# EAGLE design controller_mini (EAGLE 6.1)
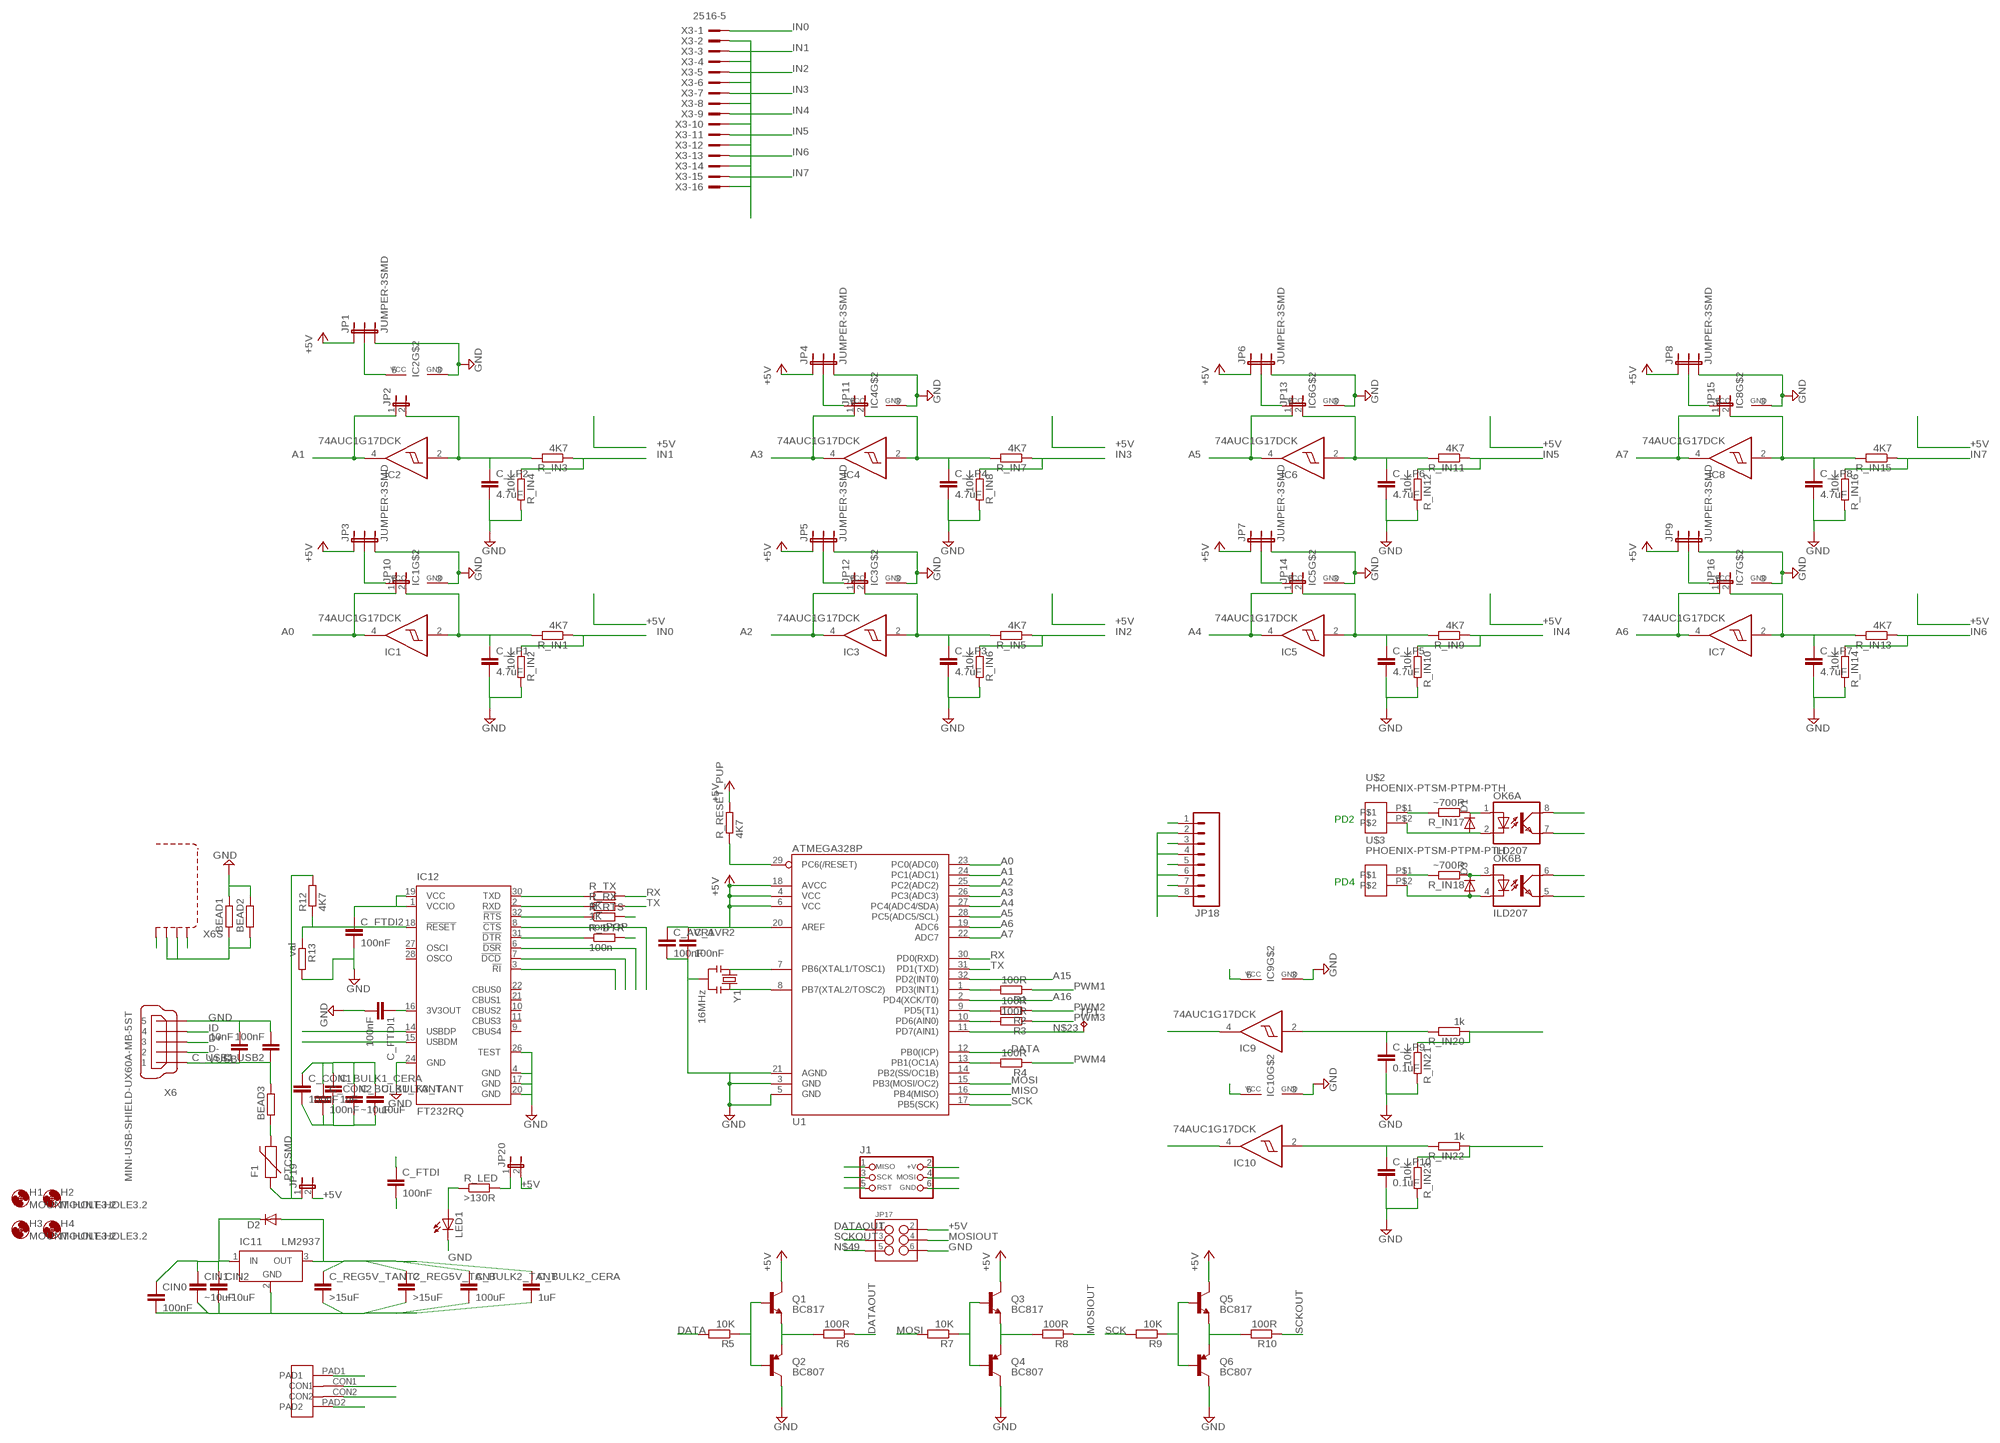
[diagram p0: schematic, sheet 1]

## Parts
BEAD1  R-EU_R0805  [R0805]
BEAD2  R-EU_R0805  [R0805]
BEAD3  R-EU_R0805  [R0805]
C_AVR1  100nF  C-EUC0805  [C0805]
C_AVR2  100nF  C-EUC0805  [C0805]
C_BULK1_CERA  1uF  C-EUC0805K  [C0805K]
C_BULK1_TANT  ~10uF  C-EUC1210  [C1210]
C_BULK2_CERA  1uF  C-EUC0805K  [C0805K]
C_BULK2_TANT  100uF  C-EUC1210  [C1210]
C_BULK3_TANT  10uF  C-EUC1210  [C1210]
C_CON1  100nF  C-EUC0805  [C0805]
C_CON2  100nF  C-EUC0805  [C0805]
C_FTDI  100nF  C-EUC0805  [C0805]
C_FTDI1  100nF  C-EUC0805  [C0805]
C_FTDI2  100nF  C-EUC0805  [C0805]
C_LP1  4.7uF  C-EUC0805  [C0805]
C_LP2  4.7uF  C-EUC0805  [C0805]
C_LP3  4.7uF  C-EUC0805  [C0805]
C_LP4  4.7uF  C-EUC0805  [C0805]
C_LP5  4.7uF  C-EUC0805  [C0805]
C_LP6  4.7uF  C-EUC0805  [C0805]
C_LP7  4.7uF  C-EUC0805  [C0805]
C_LP8  4.7uF  C-EUC0805  [C0805]
C_LP9  0.1uF  C-EUC0805  [C0805]
C_LP10  0.1uF  C-EUC0805  [C0805]
C_REG5V_TANT  >15uF  C-EUC1210  [C1210]
C_REG5V_TANT2  >15uF  C-EUC1210  [C1210]
C_USB1  10nF  C-EUC0805  [C0805]
C_USB2  100nF  C-EUC0805  [C0805]
CIN0  100nF  C-EUC0805  [C0805]
CIN1  ~10uF  C-EUC1210  [C1210]
CIN2  ~10uF  C-EUC1210  [C1210]
D1  DIODE-MICROMELF-W  [MICROMELF-W]
D2  DIODESMA  [SMA-DIODE]
D3  DIODE-MICROMELF-W  [MICROMELF-W]
F1  PTCSMD  [PTC-1206]
H1  MOUNT-HOLE3.2  [3,2]
H2  MOUNT-HOLE3.2  [3,2]
H3  MOUNT-HOLE3.2  [3,2]
H4  MOUNT-HOLE3.2  [3,2]
IC1  74AUC1G17DCK  [SC70-5]
IC2  74AUC1G17DCK  [SC70-5]
IC3  74AUC1G17DCK  [SC70-5]
IC4  74AUC1G17DCK  [SC70-5]
IC5  74AUC1G17DCK  [SC70-5]
IC6  74AUC1G17DCK  [SC70-5]
IC7  74AUC1G17DCK  [SC70-5]
IC8  74AUC1G17DCK  [SC70-5]
IC9  74AUC1G17DCK  [SC70-5]
IC10  74AUC1G17DCK  [SC70-5]
IC11  LM2937  LT1963EST-3.3  [SOT223]
IC12  FT232RQ  [QFN32]
J1  CON_HEADER_PRG_AVR_ICSP  [HEADER_PRG_2X03]
JP1  JUMPER-3SMD  [SJ_3]
JP2  JUMPER-2SMD-NO  [SJ_2S-NO]
JP3  JUMPER-3SMD  [SJ_3]
JP4  JUMPER-3SMD  [SJ_3]
JP5  JUMPER-3SMD  [SJ_3]
JP6  JUMPER-3SMD  [SJ_3]
JP7  JUMPER-3SMD  [SJ_3]
JP8  JUMPER-3SMD  [SJ_3]
JP9  JUMPER-3SMD  [SJ_3]
JP10  JUMPER-2SMD-NO  [SJ_2S-NO]
JP11  JUMPER-2SMD-NO  [SJ_2S-NO]
JP12  JUMPER-2SMD-NO  [SJ_2S-NO]
JP13  JUMPER-2SMD-NO  [SJ_2S-NO]
JP14  JUMPER-2SMD-NO  [SJ_2S-NO]
JP15  JUMPER-2SMD-NO  [SJ_2S-NO]
JP16  JUMPER-2SMD-NO  [SJ_2S-NO]
JP17  M03X2NO_SILK  [2X3-NS]
JP18  M08LOCK  [1X08_LOCK]
JP19  JUMPER-2SMD-NC  [SJ_2S]
JP20  JUMPER-2SMD-NC  [SJ_2S]
LED1  LEDCHIP-LED0805  [CHIP-LED0805]
OK6  ILD207  [SOIC08]
Q1  BC817  TRANSISTOR_NPNSOT23-3  [SOT23-3]
Q2  BC807  TRANSISTOR_PNPSMD  [SOT23-3]
Q3  BC817  TRANSISTOR_NPNSOT23-3  [SOT23-3]
Q4  BC807  TRANSISTOR_PNPSMD  [SOT23-3]
Q5  BC817  TRANSISTOR_NPNSOT23-3  [SOT23-3]
Q6  BC807  TRANSISTOR_PNPSMD  [SOT23-3]
R1  100R  R-EU_M0805  [M0805]
R2  100R  R-EU_M0805  [M0805]
R3  100R  R-EU_M0805  [M0805]
R4  100R  R-EU_R0805W  [R0805W]
R5  10K  R-EU_M0805  [M0805]
R6  100R  R-EU_M0805  [M0805]
R7  10K  R-EU_M0805  [M0805]
R8  100R  R-EU_M0805  [M0805]
R9  10K  R-EU_M0805  [M0805]
R10  100R  R-EU_M0805  [M0805]
R12  4K7  R-EU_R0805  [R0805]
R13  val  R-EU_R0805  [R0805]
R_DTR  100n  R-EU_M0805  [M0805]
R_IN1  4K7  R-EU_M0805  [M0805]
R_IN2  10K  R-EU_M0805  [M0805]
R_IN3  4K7  R-EU_M0805  [M0805]
R_IN4  10K  R-EU_M0805  [M0805]
R_IN5  4K7  R-EU_M0805  [M0805]
R_IN6  10K  R-EU_M0805  [M0805]
R_IN7  4K7  R-EU_M0805  [M0805]
R_IN8  10K  R-EU_M0805  [M0805]
R_IN9  4K7  R-EU_M0805  [M0805]
R_IN10  10K  R-EU_M0805  [M0805]
R_IN11  4K7  R-EU_M0805  [M0805]
R_IN12  10K  R-EU_M0805  [M0805]
R_IN13  4K7  R-EU_M0805  [M0805]
R_IN14  10K  R-EU_M0805  [M0805]
R_IN15  4K7  R-EU_M0805  [M0805]
R_IN16  10K  R-EU_M0805  [M0805]
R_IN17  ~700R  R-EU_M1206  [M1206]
R_IN18  ~700R  R-EU_M1206  [M1206]
R_IN20  1k  R-EU_M0805  [M0805]
R_IN21  10K  R-EU_M0805  [M0805]
R_IN22  1k  R-EU_M0805  [M0805]
R_IN23  10K  R-EU_M0805  [M0805]
R_LED  >130R  R-EU_M0805  [M0805]
R_RESET_PUP  4K7  R-EU_M0805  [M0805]
R_RTS  nonPOP  R-EU_M0805  [M0805]
R_RX  1K  R-EU_M0805  [M0805]
R_TX  1K  R-EU_M0805  [M0805]
TP1  TPTP10R  [TP10R]
U1  ATMEGA328P  ATMEGA328_SMT  [TQFP32-08]
U$1  PHOENIX-PTSM-PTPM  [PTSM-SMD-2.5MM-2]
U$2  PHOENIX-PTSM-PTPM-PTH  [PTSM-PTH-2.5MM-2]
U$3  PHOENIX-PTSM-PTPM-PTH  [PTSM-PTH-2.5MM-2]
X3  2516-5  [PAK100/2500-5-16]
X6  MINI-USB-SHIELD-UX60A-MB-5ST  [UX60A-MB-5ST]
Y1  16MHz  RESONATOR16MHZ  [RESONATOR-SMD]

## Nets
+5V: C_AVR1.1 C_AVR2.1 C_BULK1_CERA.1 C_BULK1_TANT.1 C_BULK2_CERA.1 C_BULK2_TANT.1 C_BULK3_TANT.1 C_CON1.1 C_CON2.1 C_FTDI2.1 C_FTDI.1 C_REG5V_TANT2.1 C_REG5V_TANT.1 D2.A IC9.5(VCC) IC10.5(VCC) IC11.3(OUT) IC12.1(VCCIO) IC12.19(VCC) J1.2(+V) JP1.1 JP3.1 JP4.1 JP5.1 JP6.1 JP7.1 JP8.1 JP9.1 JP17.2 JP19.2 JP20.2 OK6.6(B:COL) OK6.8(A:COL) Q1.3(C) Q3.3(C) Q5.3(C) R_RESET_PUP.2 U1.4(VCC) U1.6(VCC) U1.18(AVCC) U1.20(AREF) X3.2 X3.4 X3.6 X3.8 X3.10 X3.12 X3.14 X3.16
A0: IC1.4(O) JP10.1 U1.23(PC0(ADC0))
A1: IC2.4(O) JP2.1 U1.24(PC1(ADC1))
A2: IC3.4(O) JP12.1 U1.25(PC2(ADC2))
A3: IC4.4(O) JP11.1 U1.26(PC3(ADC3))
A4: IC5.4(O) JP14.1 U1.27(PC4(ADC4/SDA))
A5: IC6.4(O) JP13.1 U1.28(PC5(ADC5/SCL))
A6: IC7.4(O) JP16.1 U1.19(ADC6)
A7: IC8.4(O) JP15.1 U1.22(ADC7)
A15: IC9.4(O) U1.32(PD2(INT0))
A16: IC10.4(O) U1.2(PD4(XCK/T0))
D+: IC12.14(USBDP) X6.3
D-: IC12.15(USBDM) X6.2
DATA: R5.2 U1.12(PB0(ICP))
DATAOUT: JP17.1 R6.1
EROUTE: C_LP8.1 IC8.2(I) JP15.2 R_IN15.2
GND: BEAD1.2 BEAD2.2 C_AVR1.2 C_AVR2.2 C_BULK1_CERA.2 C_BULK1_TANT.2 C_BULK2_CERA.2 C_BULK2_TANT.2 C_BULK3_TANT.2 C_CON1.2 C_CON2.2 C_FTDI1.2 C_FTDI2.2 C_FTDI.2 C_LP1.2 C_LP2.2 C_LP3.2 C_LP4.2 C_LP5.2 C_LP6.2 C_LP7.2 C_LP8.2 C_LP9.2 C_LP10.2 C_REG5V_TANT2.2 C_REG5V_TANT.2 C_USB1.2 C_USB2.2 CIN0.2 CIN1.2 CIN2.2 IC1.3(GND) IC2.3(GND) IC3.3(GND) IC4.3(GND) IC5.3(GND) IC6.3(GND) IC7.3(GND) IC8.3(GND) IC9.3(GND) IC10.3(GND) IC11.2(GND) IC12.4(GND) IC12.17(GND) IC12.20(GND) IC12.24(GND) IC12.26(TEST) J1.6(GND) JP1.3 JP3.3 JP4.3 JP5.3 JP6.3 JP7.3 JP8.3 JP9.3 JP17.6 JP18.2 JP18.4 JP18.6 JP18.8 LED1.C Q2.3(C) Q4.3(C) Q6.3(C) R13.2 R_IN2.2 R_IN4.2 R_IN6.2 R_IN8.2 R_IN10.2 R_IN12.2 R_IN14.2 R_IN16.2 R_IN21.2 R_IN23.2 U1.3(GND) U1.5(GND) U1.21(AGND) U$1.CON2 U$1.PAD1 U$1.PAD2 X6.5 Y1.2
ID: X6.4
IN0: R_IN1.1 R_IN2.1 X3.1
IN1: R_IN3.1 R_IN4.1 X3.3
IN2: R_IN5.1 R_IN6.1 X3.5
IN3: R_IN7.1 R_IN8.1 X3.7
IN4: R_IN9.1 R_IN10.1 X3.9
IN5: R_IN11.1 R_IN12.1 X3.11
IN6: R_IN13.1 R_IN14.1 X3.13
IN7: R_IN15.1 R_IN16.1 X3.15
INFOMOVE: D3.A OK6.4(B:C) U$3.P$2
MISO: J1.1(MISO) U1.16(PB4(MISO))
MOSI: J1.4(MOSI) R7.2 U1.15(PB3(MOSI/OC2))
MOSIOUT: JP17.4 R8.1
N$1: C_LP9.1 IC9.2(I) R_IN20.2
N$2: C_LP2.1 IC2.2(I) JP2.2 R_IN3.2
N$3: D3.C OK6.3(B:A) R_IN18.1
N$4: C_LP3.1 IC3.2(I) JP12.2 R_IN5.2
N$5: U1.7(PB6(XTAL1/TOSC1)) Y1.1
N$6: C_LP4.1 IC4.2(I) JP11.2 R_IN7.2
N$7: D1.C OK6.1(A:A) R_IN17.1
N$8: C_LP5.1 IC5.2(I) JP14.2 R_IN9.2
N$9: BEAD3.1 F1.2
N$10: C_LP6.1 IC6.2(I) JP13.2 R_IN11.2
N$11: U1.8(PB7(XTAL2/TOSC2)) Y1.3
N$12: C_LP7.1 IC7.2(I) JP16.2 R_IN13.2
N$13: R_IN17.2 U$2.P$1
N$14: JP20.1 R_LED.2
N$15: C_LP1.1 IC1.2(I) JP10.2 R_IN1.2
N$16: R_IN18.2 U$3.P$1
N$17: Q1.2(E) Q2.2(E) R6.2
N$18: D1.A OK6.2(A:C) U$2.P$2
N$19: C_LP10.1 IC10.2(I) R_IN22.2
N$20: Q1.1(B) Q2.1(B) R5.1
N$21: OK6.7(A:EMIT) R_IN20.1 R_IN21.1
N$22: OK6.5(B:EMIT) R_IN22.1 R_IN23.1
N$23: TP1.TP U1.11(PD7(AIN1))
N$24: IC12.30(TXD) R_TX.1
N$25: IC12.2(RXD) R_RX.1
N$26: IC12.32(!RTS) R_RTS.1
N$27: IC12.31(!DTR) R_DTR.1
N$28: IC12.8(!CTS)
N$29: IC12.6(!DSR)
N$30: IC12.7(!DCD)
N$31: IC12.3(!RI)
N$32: C_FTDI1.1 IC12.16(3V3OUT)
N$33: IC2.5(VCC) JP1.2
N$34: IC1.5(VCC) JP3.2
N$35: IC4.5(VCC) JP4.2
N$36: IC3.5(VCC) JP5.2
N$37: IC6.5(VCC) JP6.2
N$38: IC5.5(VCC) JP7.2
N$39: IC8.5(VCC) JP8.2
N$40: IC7.5(VCC) JP9.2
N$42: IC12.18(!RESET) R12.1 R13.1
N$43: Q3.2(E) Q4.2(E) R8.2
N$44: Q3.1(B) Q4.1(B) R7.1
N$45: R1.2 U1.1(PD3(INT1))
N$46: R2.2 U1.9(PD5(T1))
N$47: R3.2 U1.10(PD6(AIN0))
N$48: R4.2 U1.13(PB1(OC1A))
N$49: JP17.5
N$50: LED1.A R_LED.1
N$51: Q5.2(E) Q6.2(E) R10.2
N$52: Q5.1(B) Q6.1(B) R9.1
N$54: X6.M4(S4)
N$55: X6.M1(S1)
N$58: BEAD1.1 BEAD2.1 X6.M2(S2) X6.M3(S3)
N$61: F1.1 JP19.1 R12.2
PWM1: JP18.1 R1.1
PWM2: JP18.3 R2.1
PWM3: JP18.5 R3.1
PWM4: JP18.7 R4.1
RESET: J1.5(RST) R_DTR.2 R_RESET_PUP.1 R_RTS.2 U1.29(PC6(/RESET))
RX: R_TX.2 U1.30(PD0(RXD))
SCK: J1.3(SCK) R9.2 U1.17(PB5(SCK))
SCKOUT: JP17.3 R10.1
TX: R_RX.2 U1.31(PD1(TXD))
VIN: CIN0.1 CIN1.1 CIN2.1 D2.C IC11.1(IN) U$1.CON1
VUSB: BEAD3.2 C_USB1.1 C_USB2.1 X6.1
Unconnected: IC12.9(CBUS4) IC12.10(CBUS2) IC12.11(CBUS3) IC12.21(CBUS1) IC12.22(CBUS0) IC12.27(OSCI) IC12.28(OSCO) U1.14(PB2(SS/OC1B))

## Notes on the sheet
- PD2
- PD4

## Power pins joined to a net without a drawn wire
GND: IC11.4(GND)

## Library data of the parts
BEAD1-BEAD3 R12 R13 R_IN1-R_IN18 R_IN20-R_IN23 = rcl:R-EU_: RESISTOR, European symbol
C_AVR1 C_AVR2 C_BULK1_CERA C_BULK1_TANT C_BULK2_CERA C_BULK2_TANT C_BULK3_TANT C_CON1 C_CON2 C_FTDI C_FTDI1 C_FTDI2 C_REG5V_TANT C_REG5V_TANT2 C_USB1 C_USB2 CIN0 CIN1 CIN2 = resistor:C-EU: CAPACITOR, European symbol
C_LP1-C_LP10 = rcl:C-EU: CAPACITOR, European symbol
D1 D3 = diode:DIODE-: DIODE
D2 = SparkFun-DiscreteSemi:DIODE: Diode These are standard reverse protection diodes and small signal diodes. SMA package can handle up to about 1A. SOD-323 can handle about 200mA. What the SOD-323 package when ordering, there are some mfgs out there that are 5-pin packages.
F1 = SparkFun-PowerIC:PTC: Resettable Fuse PTC Resettable Fuse. Spark Fun Electronics SKU : COM-08357
H1-H4 = holes:MOUNT-HOLE: MOUNTING HOLE with drill center marker
IC1-IC10 = 74xx-little-us:74*1G17: Single Schmitt-Trigger Buffer
IC11 = linear-technology:LT1963EST: 1.5A, Low Noise, Fast Transient Response LDO Regulator Source: http://www.linear.com/pc/downloadDocument.do?navId=H0,C3,P2222,D3148; MPN: LT1963EST-3.3; OC_FARNELL: 1501032; OC_NEWARK: 57M7546
IC12 = ftdichip:FT232R: Source: http://www.ftdichip.com/Documents/DataSheets/DS_FT232R_v104.pdf; MPN: FT232RQ; OC_FARNELL: 1146033; OC_NEWARK: 91K9919
J1 = nonolith:CON_HEADER_PRG_AVR_ICSP: 2x3 AVR ICSP programming header
JP1 JP3-JP9 = SparkFun-Passives:JUMPER-3
JP2 JP10-JP16 JP19 JP20 = SparkFun-Passives:JUMPER-2: Jumper Basic 0.1" spaced jumper. Use with breakaway headers.
JP17 = SparkFun-Connectors:M03X2: 2x3 .1" header. Shrouded, with keying- CONN-10681 SMT- CONN-11415 Pogo pins- HW-11044
JP18 = SparkFun-Connectors:M08: Header 8 Standard 8-pin 0.1" header. Use with straight break away headers (SKU : PRT-00116), right angle break away headers (PRT-00553), swiss pins (PRT-00743), machine pins (PRT-00117), and female headers (PRT-00115).
LED1 = led:LED: LED OSRAM: - CHIPLED LG R971, LG N971, LY N971, LG Q971, LY Q971, LO R971, LY R971 LH N974, LH R974 LS Q976, LO Q976, LY Q976 LO Q996 - Hyper CHIPLED LW Q18S LB Q993, LB Q99A, LB R99A - SideLED LS A670, LO A670, LY A670, LG A670, LP A670 LB A673, LV A673, LT A673, LW A673 LH A674 LY A675 LS A676, LA A676, LO A676, LY A676, LW A676 LS A679, LY A679, LG A679 - Hyper Micro SIDELED® LS Y876, LA Y876, LO Y876, LY Y876 LT Y87S - SmartLED LW L88C, LW L88S LB L89C, LB L89S, LG L890 LS L89K, LO L89K, LY L89K LS L896, LA L896, LO L896, LY L896 - TOPLED LS T670, LO T670, LY T670, LG T670, LP T670 LSG T670, LSP T670, LSY T670, LOP T670, LYG T670 LG T671, LOG T671, LSG T671 LB T673, LV T673, LT T673, LW T673 LH T674 LS T676, LA T676, LO T676, LY T676, LB T676, LH T676, LSB T676, LW T676 LB T67C, LV T67C, LT T67C, LS T67K, LO T67K, LY T67K, LW E67C LS E67B, LA E67B, LO E67B, LY E67B, LB E67C, LV E67C, LT E67C LW T67C LS T679, LY T679, LG T679 LS T770, LO T770, LY T770, LG T770, LP T770 LB T773, LV T773, LT T773, LW T773 LH T774 LS E675, LA E675, LY E675, LS T675 LS T776, LA T776, LO T776, LY T776, LB T776 LHGB T686 LT T68C, LB T68C - Hyper Mini TOPLED® LB M676 - Mini TOPLED Santana® LG M470 LS M47K, LO M47K, LY M47K Source: http://www.osram.convergy.de LUXEON: - LUMILED® LXK2-PW12-R00, LXK2-PW12-S00, LXK2-PW14-U00, LXK2-PW14-V00 LXK2-PM12-R00, LXK2-PM12-S00, LXK2-PM14-U00 LXK2-PE12-Q00, LXK2-PE12-R00, LXK2-PE12-S00, LXK2-PE14-T00, LXK2-PE14-U00 LXK2-PB12-K00, LXK2-PB12-L00, LXK2-PB12-M00, LXK2-PB14-N00, LXK2-PB14-P00, LXK2-PB14-Q00 LXK2-PR12-L00, LXK2-PR12-M00, LXK2-PR14-Q00, LXK2-PR14-R00 LXK2-PD12-Q00, LXK2-PD12-R00, LXK2-PD12-S00 LXK2-PH12-R00, LXK2-PH12-S00 LXK2-PL12-P00, LXK2-PL12-Q00, LXK2-PL12-R00 Source: www.luxeon.com KINGBRIGHT: KA-3528ASYC Source: www.kingbright.com
OK6 = optocoupler:ILD2*: Siemens ILD205/206/207/211/213/217 DUAL PHOTOTRANSISTOR SMALL OUTLINE SURFACE MOUNT OPTOCOUPLER Source: 153385-da-01-en-Optocoupler_ILD205-T.pdf; MF: VISHAY/TELEFUNKEN; MPN: ILD207T; OC_FARNELL: 1469603; OC_NEWARK: 97C8648
Q1 Q3 Q5 = SparkFun-DiscreteSemi:TRANSISTOR_NPN: Generic NPN BJT MMBT2222A - TRANS-08049 (SOT-23, 1A 40V) MPSA42 - TRANS-09116 (SOT-23, 500mA 300V) MMBT5088LT1G - TRANS-11160 (SOT-23, 50 mA 30V)
Q2 Q4 Q6 = SparkFun-DiscreteSemi:TRANSISTOR_PNP: Generic PNP BJT. Double check pinouts against datasheets- not all devices are the same!
R1-R10 R_DTR R_LED R_RESET_PUP R_RTS R_RX R_TX = resistor:R-EU_: RESISTOR, European symbol
TP1 = testpad:TP: Test pad
U1 = SparkFun-DigitalIC:ATMEGA328_SMT: 32-Pin Atmega328 part Commonly used on Arduino compatible boards Available in QFP and QFN packages TQFP is IC-09069 QFN is non-stock; PROD_ID: IC-09069
U$1 = wes:PHOENIX-PTSM-PTPM
U$2 U$3 = wes:PHOENIX-PTSM-PTPM-PTH
X3 = con-3m:2516-: 3M (TM) Pak 100 4-Wall Header Source: 3M; MPN: D2516-5002-AR; OC_FARNELL: 9838376; OC_NEWARK: 12P7055
X6 = con-hirose:MINI-USB-SHIELD-: MINI USB Connector Source: http://www.hirose.co.jp/cataloge_hp/e24000019.pdf; OC_FARNELL: unknown; OC_NEWARK: unknown
Y1 = SparkFun-FreqCtrl:RESONATOR: Resonator Small SMD resonator. Used, eg, on the Arduino Pro/ Pro Mini boards. 8MHz- XTAL-08895 16MHz- XTAL-08900; PROD_ID: XTAL-08900

## Board
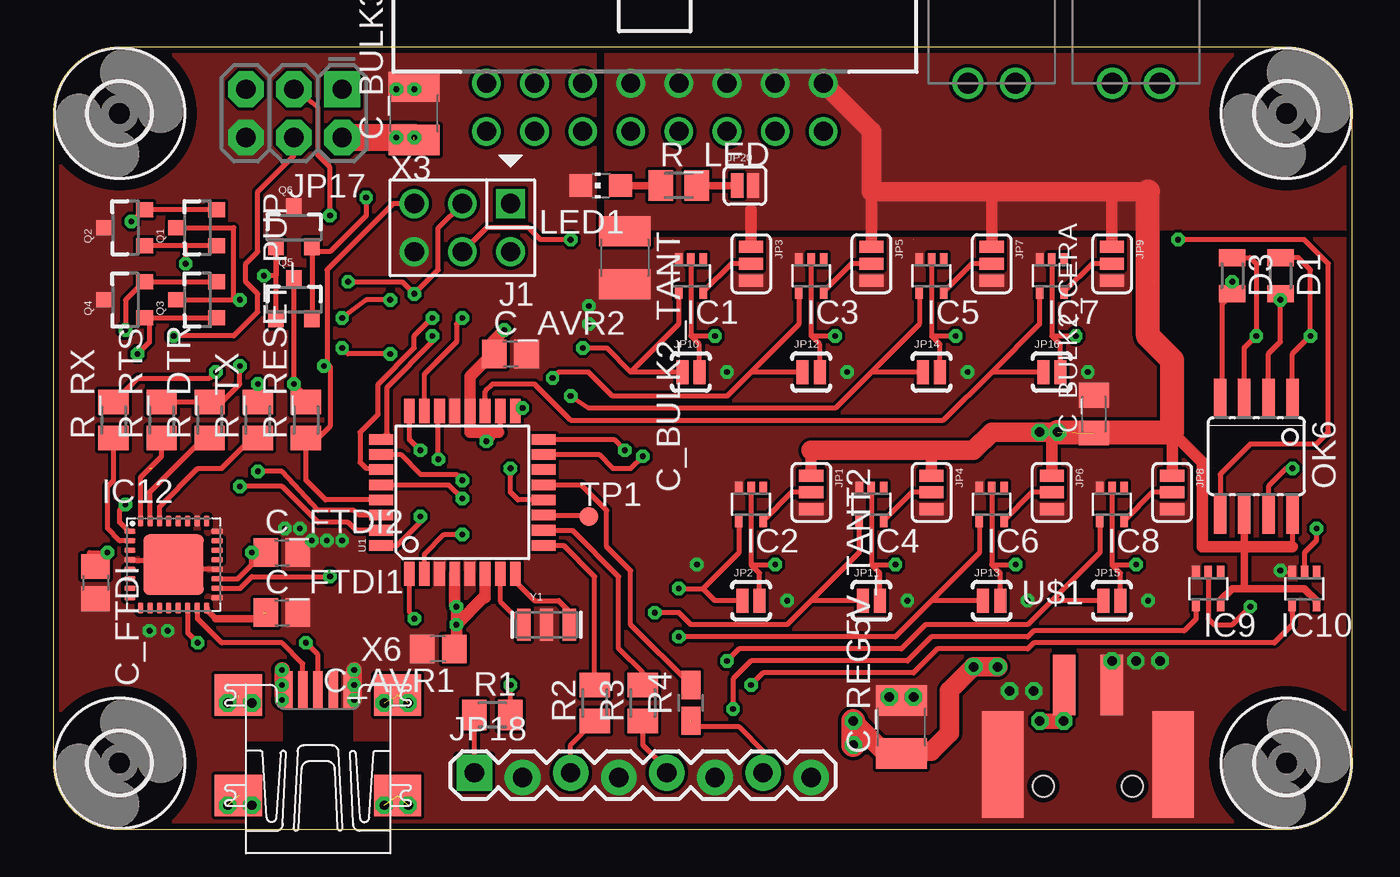
[diagram p1: board, top side]
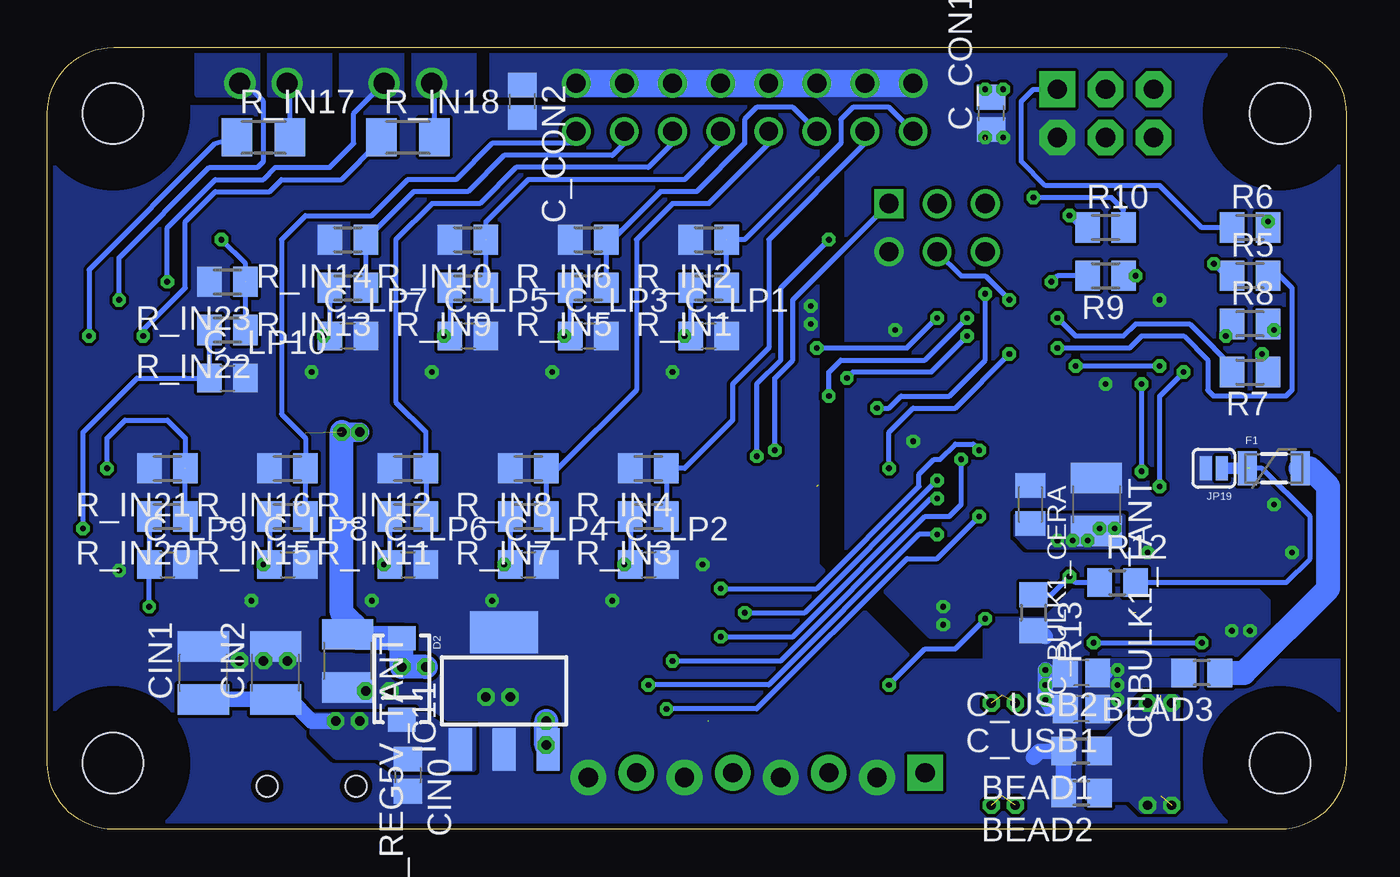
[diagram p2: board, bottom side, seen from below]

Size 68.56 x 41.26 mm. Coordinates in mm from the lower left corner, seen from the top.
Outline: 0,37.77 0,3.49 arc90 3.49,0 65.07,0 arc90 68.56,3.49 68.56,37.77 arc90 65.07,41.26 3.49,41.26 arc90 0,37.77
Copper layers (1*16): Top 0.035mm / dielectric 1.5mm / Bottom 0.035mm
Design rules: minimum track width 10mil, minimum drill 0.3mm, track to track 7mil, track to pad 7mil, pad to pad 7mil, via to via 7mil, smd to smd 6mil, copper to edge 12mil, drill to drill 8mil, minimum pad ring 10mil, minimum via ring 8mil, stop-mask expansion 4mil, vias tented up to drill 0mil, thermal gap 10mil

### Footprints (pad centres in the part's own frame; a part is rotated, then mirrored left to right if it is on the bottom)
R0805 = smd 1.3 x 1.5: 1 -0.95,0; 2 0.95,0
C0805 = smd 1.3 x 1.5: 1 -0.85,0; 2 0.85,0
C0805K = smd 1.3 x 1.6: 1 -1,0; 2 1,0
C1210 = smd 1.6 x 2.7: 1 -1.4,0; 2 1.4,0
C0805' = smd 1.3 x 1.5: 1 -0.95,0; 2 0.95,0
MICROMELF-W = smd 0.9 x 1.4: A 0.95,0; C -0.95,0
SMA-DIODE = smd 1.27 x 1.47: A -2.15,0; C 2.15,0
PTC-1206 = smd 1 x 1.8: 1 -1.4,0; 2 1.4,0
3,2 = hole 3.2: 0,0
SC70-5 = smd 0.4 x 0.7: 1 -0.65,-0.85; 2 0,-0.85; 3 0.65,-0.85; 4 0.65,0.85; 5 -0.65,0.85
SOT223 = smd 1.219 x 2.235: 1 -2.311,-3.099; 2 0,-3.099; 3 2.311,-3.099 | smd 3.6 x 2.2: 4 0,3.099
QFN32 = smd 0.6 x 0.3: 1 -2.3,1.75; 2 -2.3,1.25; 3 -2.3,0.75; 4 -2.3,0.25; 5 -2.3,-0.25; 6 -2.3,-0.75; 7 -2.3,-1.25; 8 -2.3,-1.75; 17 2.3,-1.75; 18 2.3,-1.25; 19 2.3,-0.75; 20 2.3,-0.25; 21 2.3,0.25; 22 2.3,0.75; 23 2.3,1.25; 24 2.3,1.75 | smd 0.3 x 0.6: 9 -1.75,-2.3; 10 -1.25,-2.3; 11 -0.75,-2.3; 12 -0.25,-2.3; 13 0.25,-2.3; 14 0.75,-2.3; 15 1.25,-2.3; 16 1.75,-2.3; 25 1.75,2.3; 26 1.25,2.3; 27 0.75,2.3; 28 0.25,2.3; 29 -0.25,2.3; 30 -0.75,2.3; 31 -1.25,2.3; 32 -1.75,2.3 | smd 3.2 x 3.2: EXP 0,0
HEADER_PRG_2X03 = drill 1.016 square: 1 -2.54,-1.27 | drill 1.016: 2 -2.54,1.27; 3 0,-1.27; 4 0,1.27; 5 2.54,-1.27; 6 2.54,1.27
SJ_3 = smd 0.635 x 1.27: 1 -0.889,0; 2 0,0; 3 0.889,0
SJ_2S-NO = smd 0.635 x 1.27: 1 -0.45,0; 2 0.45,0
2X3-NS = drill 1.016 pad 1.88 square: 1 -2.54,-1.27 | drill 1.016 pad 1.88 octagon: 2 -2.54,1.27; 3 0,-1.27; 4 0,1.27; 5 2.54,-1.27; 6 2.54,1.27
1X08_LOCK = drill 1.016 pad 1.88 square: 1 0,0.127 | drill 1.016 pad 1.88: 2 2.54,-0.127; 3 5.08,0.127; 4 7.62,-0.127; 5 10.16,0.127; 6 12.7,-0.127; 7 15.24,0.127; 8 17.78,-0.127
SJ_2S = smd 0.635 x 1.27: 1 -0.412,0; 2 0.412,0
CHIP-LED0805 = smd 1.2 x 1.2: A 0,-1.05; C 0,1.05
SOIC08 = smd 0.66 x 2.032: 1 -1.905,-3.073; 2 -0.635,-3.073; 3 0.635,-3.073; 4 1.905,-3.073; 5 1.905,3.073; 6 0.635,3.073; 7 -0.635,3.073; 8 -1.905,3.073
SOT23-3 = smd 0.8 x 0.9: 1 -0.95,-1; 2 0.95,-1; 3 0,1.1
M0805 = smd 1.3 x 1.6: 1 -0.95,0; 2 0.95,0
R0805W = smd 1.5 x 1: 1 -0.94,0; 2 0.94,0
M1206 = smd 1.6 x 2: 1 -1.4,0; 2 1.4,0
TP10R = smd 1 x 1: TP 0,0
TQFP32-08 = smd 1.27 x 0.559: 1 -4.293,2.8; 2 -4.293,2; 3 -4.293,1.2; 4 -4.293,0.4; 5 -4.293,-0.4; 6 -4.293,-1.2; 7 -4.293,-2; 8 -4.293,-2.8; 17 4.293,-2.8; 18 4.293,-2; 19 4.293,-1.2; 20 4.293,-0.4; 21 4.293,0.4; 22 4.293,1.2; 23 4.293,2; 24 4.293,2.8 | smd 0.559 x 1.27: 9 -2.8,-4.293; 10 -2,-4.293; 11 -1.2,-4.293; 12 -0.4,-4.293; 13 0.4,-4.293; 14 1.2,-4.293; 15 2,-4.293; 16 2.8,-4.293; 25 2.8,4.293; 26 2,4.293; 27 1.2,4.293; 28 0.4,4.293; 29 -0.4,4.293; 30 -1.2,4.293; 31 -2,4.293; 32 -2.8,4.293
PTSM-SMD-2.5MM-2 = smd 1.2 x 3.2: CON1 -1.25,0; CON2 1.25,0 | smd 2.2 x 5.6: PAD1 4.5,-4.2; PAD2 -4.5,-4.2 | hole 1.1: -2.35,-5.35; 2.35,-5.35
PTSM-PTH-2.5MM-2 = drill 1.1: P$1 -1.25,0; P$2 1.25,0
PAK100/2500-5-16 = drill 1 pad 1.422: 1 -8.89,-1.27; 2 -8.89,1.27; 3 -6.35,-1.27; 4 -6.35,1.27; 5 -3.81,-1.27; 6 -3.81,1.27; 7 -1.27,-1.27; 8 -1.27,1.27; 9 1.27,-1.27; 10 1.27,1.27; 11 3.81,-1.27; 12 3.81,1.27; 13 6.35,-1.27; 14 6.35,1.27; 15 8.89,-1.27; 16 8.89,1.27
UX60A-MB-5ST = smd 2 x 0.5: 1 2.25,1.6; 2 2.25,0.8; 3 2.25,0; 4 2.25,-0.8; 5 2.25,-1.6 | smd 2.2 x 2.5: M1 -3.3,-4.2; M2 -3.3,4.2; M3 2,4.2; M4 2,-4.2
RESONATOR-SMD = smd 0.7 x 1.7: 1 -1.2,0; 2 0,0; 3 1.2,0

### Placement (x,y rotation side)
BEAD1  13.97,4.13 180 bottom
BEAD2  13.97,1.91 180 bottom
BEAD3  7.62,8.26 180 bottom
C_AVR1  20.32,9.53 180 top
C_AVR2  24.13,25.08 0 top
C_BULK1_CERA  16.67,17.14 270 bottom
C_BULK1_TANT  13.18,17.14 270 bottom
C_BULK2_CERA  54.93,21.91 90 top
C_BULK2_TANT  30.16,30.16 270 top
C_BULK3_TANT  19.05,37.78 90 top
C_CON1  18.73,37.78 90 bottom
C_CON2  43.5,38.42 270 bottom
C_FTDI  2.22,13.02 270 top
C_FTDI1  12.06,11.43 0 top
C_FTDI2  12.06,14.61 0 top
C_LP1  4.7uF  [C0805']  33.66,26.04 0 bottom
C_LP2  4.7uF  [C0805']  36.83,13.97 0 bottom
C_LP3  4.7uF  [C0805']  40.01,26.04 0 bottom
C_LP4  4.7uF  [C0805']  43.18,13.97 0 bottom
C_LP5  4.7uF  [C0805']  46.35,26.04 0 bottom
C_LP6  4.7uF  [C0805']  49.53,13.97 0 bottom
C_LP7  4.7uF  [C0805']  52.7,26.04 0 bottom
C_LP8  4.7uF  [C0805']  55.88,13.97 0 bottom
C_LP9  0.1uF  [C0805']  62.23,13.97 0 bottom
C_LP10  0.1uF  [C0805']  59.05,23.81 0 bottom
C_REG5V_TANT  52.7,8.89 270 bottom
C_REG5V_TANT2  44.77,5.4 90 top
C_USB1  13.97,6.35 180 bottom
C_USB2  13.97,8.26 180 bottom
CIN0  49.53,2.86 270 bottom
CIN1  60.33,8.26 90 bottom
CIN2  56.52,8.26 90 bottom
D1  64.77,29.21 270 top
D2  49.85,7.94 270 bottom
D3  62.23,29.21 270 top
F1  3.81,19.05 0 bottom
H1  3.49,3.49 0 top
H2  65.09,3.49 0 top
H3  3.49,37.78 0 top
H4  65.09,37.78 0 top
IC1  33.66,29.21 180 top
IC2  36.83,17.14 180 top
IC3  40.01,29.21 180 top
IC4  43.18,17.14 180 top
IC5  46.35,29.21 180 top
IC6  49.53,17.14 180 top
IC7  52.7,29.21 180 top
IC8  55.88,17.14 180 top
IC9  60.96,12.7 180 top
IC10  66.04,12.7 180 top
IC11  44.45,7.3 0 bottom
IC12  6.35,13.97 0 top
J1  21.59,31.75 180 top
JP1  40.01,17.78 270 top
JP2  36.83,12.06 0 top
JP3  36.83,29.84 270 top
JP4  46.35,17.78 270 top
JP5  43.18,29.84 270 top
JP6  52.7,17.78 270 top
JP7  49.53,29.84 270 top
JP8  59.05,17.78 270 top
JP9  55.88,29.84 270 top
JP10  33.66,24.13 0 top
JP11  43.18,12.06 0 top
JP12  40.01,24.13 0 top
JP13  49.53,12.06 0 top
JP14  46.35,24.13 0 top
JP15  55.88,12.06 0 top
JP16  52.7,24.13 0 top
JP17  12.7,37.78 180 top
JP18  22.23,2.86 0 top
JP19  6.99,19.05 180 bottom
JP20  36.51,33.97 0 top
LED1  28.89,33.97 90 top
OK6  63.5,19.68 180 top
Q1  7.62,31.75 90 top
Q2  3.81,31.75 90 top
Q3  7.62,27.94 90 top
Q4  3.81,27.94 90 top
Q5  12.7,27.94 0 top
Q6  12.7,31.75 0 top
R1  23.18,6.03 0 top
R2  28.57,6.67 90 top
R3  31.11,6.67 90 top
R4  33.66,6.67 90 top
R5  5.08,29.21 0 bottom
R6  5.08,31.75 0 bottom
R7  5.08,24.13 180 bottom
R8  5.08,26.67 0 bottom
R9  12.7,29.21 180 bottom
R10  12.7,31.75 0 bottom
R12  12.06,13.02 0 bottom
R13  16.51,11.43 270 bottom
R_DTR  8.26,21.59 90 top
R_IN1  33.66,28.57 180 bottom
R_IN2  33.66,31.11 180 bottom
R_IN3  36.83,16.51 180 bottom
R_IN4  36.83,19.05 180 bottom
R_IN5  40.01,28.57 180 bottom
R_IN6  40.01,31.11 180 bottom
R_IN7  43.18,16.51 180 bottom
R_IN8  43.18,19.05 180 bottom
R_IN9  46.35,28.57 180 bottom
R_IN10  46.35,31.11 180 bottom
R_IN11  49.53,16.51 180 bottom
R_IN12  49.53,19.05 180 bottom
R_IN13  52.7,28.57 180 bottom
R_IN14  52.7,31.11 180 bottom
R_IN15  55.88,16.51 180 bottom
R_IN16  55.88,19.05 180 bottom
R_IN17  57.15,36.51 0 bottom
R_IN18  49.53,36.51 0 bottom
R_IN20  62.23,16.51 180 bottom
R_IN21  62.23,19.05 180 bottom
R_IN22  59.05,26.35 180 bottom
R_IN23  59.05,28.89 180 bottom
R_LED  33.02,33.97 0 top
R_RESET_PUP  13.34,21.59 90 top
R_RTS  5.71,21.59 90 top
R_RX  3.17,21.59 90 top
R_TX  10.79,21.59 90 top
TP1  28.26,16.51 0 top
U1  21.59,17.78 90 top
U$1  54.61,7.62 0 top
U$2  57.15,39.37 0 top
U$3  49.53,39.37 0 top
X3  31.75,38.1 0 top
X6  13.97,5.08 90 top
Y1  26.04,10.79 0 top

### Tracks (layer width: path | path; a pad name or v marks a point on that pad's centre or on a via)
+5V  (via drill 0.3, 0.5)  (2 unrouted)
  Top 0.254: C_FTDI2.1 v10.48,14.61 10.48,13.97 9.73,13.22 IC12.19 | IC12.1 3.96,15.72 3.49,16.19 3.49,16.83 v3.81,17.14 | U1.18 23.59,21.05 23.5,20.95 | OK6.8 65.41,14.92 | Q1.3 9.53,31.75 9.53,27.94 | Q3.3 9.53,27.94 | Q5.3 v12.7,23.5 13.34,22.86 R_RESET_PUP.2 | 9.53,27.94 v9.84,27.94 | 36.83,33.88 JP20.2 | 21.19,11.83 v21.27,11.75 | 59.1,23.45 59.05,23.5 | C_FTDI.1 1.91,14.61 v2.86,14.61
  Top 0.406: IC10.5 66.69,12.05 66.04,12.7 62.87,12.7 | OK6.6 62.87,14.92 62.87,12.7 | IC9.5 61.61,12.08 62.23,12.7 62.87,12.7
  Top 0.61: JP3.1 36.83,32.7 | JP5.1 43.18,33.66 | JP7.1 49.53,33.66 | JP9.1 55.88,33.66 | JP1.1 40.01,20 | v53.02,20.95 52.7,20.95 JP6.1 | JP8.1 59.05,20.95 60.64,19.37 60.64,14.92 62.87,14.92 65.41,14.92 | JP4.1 46.35,20 | 23.18,20.95 21.99,20.95 U1.20 21.99,23.89 23.18,25.08 | 23.18,20.95 23.5,20.95 | v21.27,11.75 v21.27,10.79 | U1.6 22.79,12.21 22.69,12.21 v21.27,10.79 | v22.86,20.48 23.18,20.95 | U1.4 21.19,11.83 | C_AVR2.1 23.18,25.08 | v23.81,26.35 23.18,25.72 23.18,25.08 | v21.27,10.79 21.27,9.63 C_AVR1.1
  Top 0.813: 58.87,24.58 59.05,24.77
  Top 1.016: 40.01,20 46.35,20 48.58,20 49.53,20.95 v52.07,20.95 v53.02,20.95 | 57.78,33.66 55.88,33.66 49.53,33.66 43.18,33.66 43.18,36.83 X3.16 | v49.85,8.57 v48.58,8.57 47.31,7.3 47.31,5.08 46.35,4.13 44.9,4.13 C_REG5V_TANT2.1 44,3.94 v42.23,5.71
  Top 1.27: v53.02,20.95 59.05,20.95 59.05,23.5 59.05,24.77 57.78,26.04 57.78,33.66 | v42.23,4.45 v42.23,5.71
  Top 1.422: JP17.2 v18.1,36.51 v19.05,36.51
  Bottom 0.813: IC11.3 42.32,4.99 v42.23,5.71 | 52.19,10.09 C_REG5V_TANT.1
  Bottom 1.016: v53.02,20.95 v52.07,20.95
  Bottom 1.27: v42.23,4.45 v42.23,5.71 | 52.19,10.09 D2.A v49.85,8.57 v48.58,8.57 | C_REG5V_TANT.1 52.39,10.79 53.02,11.43 v53.02,20.95
  Bottom 1.422: X3.16 X3.14 X3.12 X3.10 X3.8 X3.6 X3.4 X3.2
  pour Bottom (rank 6, no thermals): -7.62,10.16 21.91,10.16 26.35,14.61 26.35,37.15 27.94,38.73 45.09,38.73 45.09,43.18 -7.62,43.18
  pour Top (no thermals): 29.21,45.72 29.21,31.75 71.12,31.75 71.12,45.72
A0  (via drill 0.3)
  Top 0.254: IC1.4 33.01,26.66 30.48,24.13 | JP10.1 30.48,24.13 | U1.23 19.59,24.04 21.27,25.72 21.27,26.67 v21.59,26.99 | v27.94,25.4 29.21,25.4 30.48,24.13
  Bottom 0.254: v27.94,25.4 23.18,25.4 v21.59,26.99
A1  (via drill 0.3)
  Top 0.254: IC2.4 36.18,14.59 34.29,12.7 | v33.02,12.7 34.29,12.7 | U1.24 18.79,20.58 v19.37,20 | JP2.1 34.92,12.06 34.29,12.7
  Bottom 0.254: v33.02,12.7 27.94,12.7 22.54,18.1 22.54,18.73 21.75,19.53 21.43,19.53 20.64,20.32 19.68,20.32 v19.37,20
A2  (via drill 0.3)
  Top 0.254: IC3.4 39.35,26.66 36.83,24.13 | 36.83,24.13 35.56,22.86 29.53,22.86 28.26,24.13 26.67,24.13 v26.35,23.81 | JP12.1 36.83,24.13 | U1.25 17.62,20.9 17.62,23.34 20,25.72 v20,26.04
  Bottom 0.254: v20,26.04 21.91,24.13 26.04,24.13 v26.35,23.81
A3  (via drill 0.3)
  Top 0.254: IC4.4 42.53,14.59 40.01,12.06 | 40.01,12.06 38.73,10.79 33.66,10.79 33.02,11.43 v31.75,11.43 | JP11.1 40.01,12.06 | U1.26 18.32,19.78 19.37,18.73 21.27,18.73 v21.59,18.41
  Bottom 0.254: v31.75,11.43 28.57,11.43 v21.59,18.41
A4  (via drill 0.3)
  Top 0.254: IC5.4 45.7,26.66 43.18,24.13 | 43.18,24.13 41.27,22.23 28.26,22.23 v27.3,22.86 | JP14.1 43.18,24.13 | U1.27 17.23,19.05 16.51,19.05 16.19,19.37 16.19,20.95 17.14,21.91 17.14,23.5 19.05,25.4 19.05,26.04 v20,26.99
  Bottom 0.254: v27.3,22.86 27.3,24.13 26.67,24.77 22.23,24.77 v20,26.99
A5  (via drill 0.3)
  Top 0.254: IC6.4 48.88,14.59 46.35,12.06 | 46.35,12.06 44.45,10.16 v33.02,10.16 | JP13.1 46.35,12.06 | U1.28 20.87,18.18 v21.59,17.46
  Bottom 0.254: v33.02,10.16 29.21,10.16 21.91,17.46 v21.59,17.46
A6
  Top 0.254: IC7.4 52.05,26.66 49.53,24.13 | JP16.1 49.53,24.13 | 49.53,24.13 46.99,21.59 27.3,21.59 25.4,23.5 23.18,23.5 22.79,23.11 U1.19
A7  (via drill 0.3)
  Top 0.254: IC8.4 55.23,14.59 52.7,12.06 | JP15.1 52.7,12.06 | v20.32,19.53 20.32,21.59 20.39,21.66 U1.22 | v35.56,8.89 36.2,9.53 44.77,9.53 46.04,10.79 51.44,10.79 52.7,12.06
  Bottom 0.254: v35.56,8.89 29.84,8.89 22.23,16.51 20.95,16.51 20.32,17.14 v20.32,19.53
A15  (via drill 0.3)
  Top 0.254: 16.89,14.98 U1.32 18.16,14.98 19.37,16.19 v19.37,16.51 | IC9.4 60.31,11.1 59.69,10.48 51.75,10.48 51.44,10.16 46.35,10.16 45.09,8.89 36.83,8.89 35.88,7.94 v35.88,6.35
  Bottom 0.254: v35.88,6.35 31.11,6.35 23.18,14.29 21.59,14.29 v19.37,16.51
A16  (via drill 0.3)
  Top 0.254: IC10.4 65.39,11.45 65.41,10.79 64.45,9.84 51.75,9.84 51.44,9.53 46.67,9.53 45.4,8.26 37.47,8.26 v36.83,7.62 | U1.2 19.59,14.51 20.64,15.56 v21.59,15.56
  Bottom 0.254: v21.59,15.56 22.54,15.56 30.48,7.62 v36.83,7.62
D+  (via drill 0.3)
  Top 0.254: IC12.14 7.1,10.36 v7.62,9.84 | v13.34,9.84 13.97,9.21 X6.3
  Bottom 0.254: v13.34,9.84 v7.62,9.84
D-
  Top 0.254: IC12.15 7.6,11.13 8.89,9.84 12.06,9.84 13.17,8.74 X6.2
DATA  (via drill 0.3)
  Top 0.254: U1.12 24.53,17.38 24.13,17.78 v24.13,19.05 | v17.78,25.08 15.56,25.08 v15.24,25.4
  Bottom 0.254: v24.13,19.05 24.13,20.95 22.86,22.23 20.64,22.23 v17.78,25.08 | R5.2 3.81,29.53 2.86,28.57 2.86,23.18 3.17,22.86 6.99,22.86 7.3,23.18 7.3,24.77 8.57,26.04 10.79,26.04 11.43,25.4 v15.24,25.4
DATAOUT
  Bottom 0.254: R6.1 7.62,31.75 9.84,33.97 15.88,33.97 17.14,35.24 17.14,38.42 16.51,39.05 JP17.1
EROUTE  (via drill 0.3)
  Top 0.254: 55.88,13.97 v57.15,13.97 | IC8.2 55.88,13.97 | JP15.2 56.33,13.52 55.88,13.97
  Bottom 0.254: R_IN15.2 C_LP8.1
  Bottom 0.406: v57.15,13.97 C_LP8.1
GND  (via drill 0.3, 0.5)
  Top 0.254: IC10.3 65.19,13.55 | 4.05,14.21 5.79,14.21 | 8.57,13.73 7.14,13.73
  Top 0.813: v15.88,8.41 v15.88,7.62 v15.88,6.83
  Bottom 0.254: C_BULK1_TANT.2 13.34,15.56 v13.65,15.24
  Bottom 0.406: C_CON1.2 18.2,38.63 v18.1,39.05
  Bottom 0.813: C_USB2.2 15.56,8.26 v15.88,8.41 v15.88,7.62 v15.88,6.83 15.56,6.35 C_USB1.2 | R13.2 16.2,10.48 15.88,10.16 | BEAD2.2 BEAD1.2 16.19,4.13 16.51,3.81
  other vias: 64.77,13.65 5.08,10.48 6.03,10.48 57.78,12.06 51.44,12.06 45.09,12.06 38.73,12.06 35.56,24.13 41.91,24.13 48.26,24.13 54.61,24.13 33.97,13.97 55.88,8.89 51.75,7.3 44.13,6.99 45.4,6.99 58.42,8.89 57.15,8.89 12.22,15.88 19.05,39.05 28.26,26.67 28.26,27.62 14.45,15.24 15.24,15.24 13.02,15.88 50.48,7.3
  pour Bottom (rank 6, no thermals): -7.62,8.89 -7.62,-7.62 80.01,-7.62 80.01,38.1 27.94,38.1 27.94,13.97 22.86,8.89
  pour Top (no thermals): -7.62,48.26 -7.62,-7.62 76.2,-7.62 76.2,31.11 28.57,31.11 28.57,48.26
  pour Bottom (no thermals): 4.13,10.79 5.71,9.21 14.29,9.21 14.29,5.4 16.51,5.4 19.05,8.26 19.05,11.11 15.88,11.11 14.29,12.7 4.76,12.7 4.13,12.06
  pour Bottom (no thermals): 11.75,16.51 17.46,16.51 17.46,15.56 16.83,14.92 11.75,14.92
IN0  (1 unrouted)
  Bottom 0.254: X3.1 24.13,38.1 26.04,38.1 26.67,37.47 26.67,36.2 31.75,31.11 R_IN2.1 | R_IN1.1 R_IN2.1
IN1
  Bottom 0.254: X3.3 25.4,36.2 30.48,31.11 30.48,25.4 32.38,23.5 32.38,21.59 34.92,19.05 R_IN4.1 R_IN3.1
IN2
  Bottom 0.254: X3.5 29.21,38.1 31.11,38.1 31.75,37.47 31.75,36.2 34.29,33.66 36.2,33.66 38.73,31.11 38.1,31.75 R_IN6.1 R_IN5.1
IN3
  Bottom 0.254: X3.7 30.48,36.2 33.66,33.02 35.56,33.02 37.47,31.11 37.47,23.18 41.59,19.05 R_IN8.1 R_IN7.1
IN4  (1 unrouted)
  Bottom 0.254: X3.9 33.02,36.2 34.92,34.29 43.18,34.29 45.41,32.06 R_IN10.1 | R_IN9.1 R_IN10.1
IN5
  Bottom 0.254: X3.11 35.56,36.2 36.83,34.92 43.81,34.92 45.72,33.02 48.26,33.02 50.16,31.11 50.16,22.54 48.58,20.95 R_IN12.1 R_IN11.1
IN6
  Bottom 0.254: X3.13 38.1,36.2 38.73,35.56 44.45,35.56 46.35,33.66 49.22,33.66 R_IN14.1 R_IN13.1
IN7  (1 unrouted)
  Bottom 0.254: X3.15 40.64,36.2 45.09,36.2 46.99,34.29 49.53,34.29 51.44,32.38 54.93,32.38 56.2,31.11 56.2,21.91 54.93,20.64 R_IN16.1 R_IN15.1
INFOMOVE  (via drill 0.3)
  Top 0.254: OK6.4 61.7,23.39 61.7,27.72 D3.A v62.23,28.89
  Bottom 0.254: v62.23,28.89 62.23,31.75 59.69,34.29 57.15,34.29 56.52,34.92 53.66,34.92 52.39,36.2 52.39,37.78 50.8,39.37
  pour Bottom (no thermals): 49.85,41.27 49.85,38.73 53.02,38.73 53.02,41.27
MISO  (via drill 0.3)
  Top 0.254: U1.16 29.59,20.58 v30.16,20
  Bottom 0.254: v30.16,20 30.16,23.81 29.21,24.77 29.21,27.94 J1.1
MOSI  (via drill 0.3)
  Top 0.254: U1.15 28.8,19.78 29.53,19.05 30.48,19.05 v31.11,19.68 | v27.3,31.11 25.72,31.11 25.08,31.75 22.86,31.75 J1.4 | v17.78,27.94 16.51,27.94 v15.24,26.99
  Bottom 0.254: v27.3,31.11 29.84,28.57 29.84,24.77 31.11,23.5 v31.11,19.68 | J1.4 20.32,29.21 19.05,29.21 v17.78,27.94 | R7.2 5.71,24.13 8.26,26.67 11.11,26.67 11.75,26.04 14.29,26.04 v15.24,26.99
MOSIOUT  (via drill 0.3)
  Top 0.254: JP17.4 12.7,35.56 10.79,33.66 10.79,30.48 10.16,29.84 10.16,28.89 10.79,28.26 10.79,27.3 9.53,26.04 v6.35,26.04
  Bottom 0.254: v6.35,26.04 5.71,26.36 R8.1
N$1  (via drill 0.3)
  Top 0.254: IC9.2 60.96,11.11 61.28,10.79 62.23,10.79 v63.18,11.75
  Bottom 0.254: R_IN20.2 C_LP9.1 v63.18,11.75
N$2  (via drill 0.3)
  Top 0.254: IC2.2 36.83,13.97 | 36.83,13.97 v38.1,13.97 | JP2.2 37.28,13.52 36.83,13.97
  Bottom 0.254: R_IN3.2 C_LP2.1
  Bottom 0.406: v38.1,13.97 C_LP2.1
N$3  (via drill 0.3)
  Top 0.254: OK6.3 62.87,25.4 v63.5,26.04 63.5,29.84 63.18,30.16 D3.C
  Bottom 0.254: R_IN18.1 51.12,36.2 53.02,34.29 56.2,34.29 56.83,33.66 59.69,33.66 61.28,32.07 61.28,28.57 63.5,26.35 v63.5,26.04
N$4  (via drill 0.3)
  Top 0.254: IC3.2 40.01,26.04 | 40.01,26.04 v41.27,26.04 | JP12.2 40.45,25.59 40.01,26.04
  Bottom 0.254: R_IN5.2 C_LP3.1
  Bottom 0.406: v41.27,26.04 C_LP3.1
N$5
  Top 0.254: U1.7 23.59,12.04 Y1.1
N$6  (via drill 0.3)
  Top 0.254: IC4.2 43.18,13.97 | 43.18,13.97 v44.45,13.97 | JP11.2 43.63,13.52 43.18,13.97
  Bottom 0.254: R_IN7.2 C_LP4.1
  Bottom 0.406: v44.45,13.97 C_LP4.1
N$7  (via drill 0.3)
  Top 0.254: OK6.1 65.41,25.08 v66.36,26.04 66.36,29.53 65.72,30.16 D1.C
  Bottom 0.254: 58.74,36.2 R_IN17.1 59.69,36.2 66.36,29.53 v66.36,26.04
N$8  (via drill 0.3)
  Top 0.254: IC5.2 46.35,26.04 | 46.35,26.04 v47.62,26.04 | JP14.2 46.8,25.59 46.35,26.04
  Bottom 0.254: R_IN9.2 C_LP5.1
  Bottom 0.406: v47.62,26.04 C_LP5.1
N$9
  Bottom 1.27: BEAD3.1 5.4,8.26 0.95,12.7 0.95,18.1 1.91,19.05 F1.2
N$10  (via drill 0.3)
  Top 0.254: IC6.2 49.53,13.97 | 49.53,13.97 v50.8,13.97 | JP13.2 49.98,13.52 49.53,13.97
  Bottom 0.254: R_IN11.2 C_LP6.1
  Bottom 0.406: v50.8,13.97 C_LP6.1
N$11
  Top 0.254: U1.8 24.39,13.07 25.4,12.06 26.67,12.06 27.3,11.43 27.3,10.23 Y1.3
N$12  (via drill 0.3)
  Top 0.254: IC7.2 52.7,26.04 | 52.7,26.04 v53.98,26.04 | JP16.2 53.16,25.59 52.7,26.04
  Bottom 0.254: R_IN13.2 C_LP7.1
  Bottom 0.406: v53.98,26.04 C_LP7.1
N$13
  Bottom 0.254: R_IN17.2 55.75,39.22 U$2.P$1
  pour Bottom (no thermals): 53.66,41.27 53.66,38.73 56.83,38.73 56.83,41.27
N$14
  Top 0.406: JP20.1 R_LED.2
N$15  (via drill 0.3)
  Top 0.254: IC1.2 33.66,26.04 | 33.66,26.04 v34.92,26.04 | JP10.2 34.1,25.59 33.66,26.04
  Bottom 0.254: R_IN1.2 C_LP1.1
  Bottom 0.406: 34.29,25.72 C_LP1.1 v34.92,26.04
N$16
  Bottom 0.254: R_IN18.2 48.13,39.22 U$3.P$1
  pour Bottom (no thermals): 46.04,41.27 46.04,38.73 49.21,38.73 49.21,41.27
N$17  (via drill 0.3)
  Top 0.254: Q1.2 Q2.2 4.76,32.7 v4.13,32.07
  Bottom 0.254: 4.13,31.43 R6.2 v4.13,32.06 v4.13,32.07
N$18  (via drill 0.3)
  Top 0.254: D1.A v64.77,27.94 64.77,25.72 64.14,25.08 OK6.2
  Bottom 0.254: v64.77,27.94 64.77,30.16 60.01,34.92 57.47,34.92 57.15,35.24 57.15,38.42 58.1,39.37 58.42,39.37
  pour Bottom (no thermals): 57.47,41.27 57.47,38.73 60.64,38.73 60.64,41.27
N$19  (via drill 0.3)
  Top 0.254: v66.67,15.88 66.67,15.24 66.04,14.61 IC10.2
  Bottom 0.254: v66.67,15.88 66.67,20.95 63.82,23.81 61.28,23.81 60.32,23.82 C_LP10.1 R_IN22.2
N$20  (via drill 0.3)
  Top 0.254: Q1.1 6.99,30.8 | 6.99,30.8 Q2.1 | v6.99,29.84 6.99,30.8
  Bottom 0.254: R5.1 6.35,29.21 v6.99,29.84
N$21  (via drill 0.3)  (1 unrouted)
  Top 0.254: v65.41,19.05 65.09,19.05 64.14,18.1 OK6.7
  Bottom 0.254: R_IN20.1 R_IN21.1 | v65.41,19.05 65.41,20.64 64.45,21.59 62.23,21.59 61.28,20.64 R_IN21.1
N$22  (via drill 0.3)  (1 unrouted)
  Top 0.254: v59.37,31.11 66.04,31.11 67.31,29.84 67.31,20.95 66.67,20.32 63.18,20.32 61.59,18.73 OK6.5
  Bottom 0.254: R_IN22.1 R_IN23.1 58.1,29.84 v59.37,31.11
N$23
  Top 0.254: U1.11 28.5,16.58 TP1.TP
N$24
  Top 0.254: IC12.30 5.6,17.03 7.62,19.05 8.89,19.05 10.16,20.32 R_TX.1
N$25
  Top 0.254: R_RX.1 3.17,18.41 2.86,18.1 2.86,15.88 3.51,15.22 IC12.2
N$26
  Top 0.254: IC12.32 4.6,18.57 5.71,19.68 R_RTS.1
N$27
  Top 0.254: IC12.31 5.1,17.76 5.08,17.78 7.62,20.32 R_DTR.1
N$32  (1 unrouted)
  Top 0.305: IC12.16 8.1,11.59 8.57,11.11
  Top 0.406: 8.57,11.11 10.79,11.11 11.11,11.43
N$33
  Top 0.254: JP1.2 38.97,17.78 IC2.5
N$34
  Top 0.254: JP3.2 35.79,29.84 IC1.5
N$35
  Top 0.254: JP4.2 45.31,17.78 IC4.5
N$36
  Top 0.254: JP5.2 42.14,29.84 IC3.5
N$37
  Top 0.254: JP6.2 51.66,17.78 IC6.5
N$38
  Top 0.254: JP7.2 48.49,29.84 IC5.5
N$39
  Top 0.254: JP8.2 58.02,17.78 IC8.5
N$40
  Top 0.254: JP9.2 54.84,29.84 IC7.5
N$42  (via drill 0.3)
  Top 0.254: IC12.18 9.86,12.72 10.48,13.34 v14.61,13.34
  Bottom 0.254: R13.1 15.56,12.38 v14.61,13.34 14.29,13.02 R12.1
N$43  (via drill 0.3)
  Top 0.254: Q3.2 Q4.2 4.76,28.89 3.81,27.94 v3.81,26.35
  Bottom 0.254: v3.81,26.35 R8.2
N$44  (via drill 0.3)
  Top 0.254: Q3.1 Q4.1 5.08,26.72 5.08,25.72 v4.45,25.08
  Bottom 0.254: R7.1 3.81,24.13 v4.45,25.08
N$45  (via drill 0.3)
  Top 0.254: R1.2 v24.13,7.62 | U1.1 18.79,11.49 v19.05,11.11
  Bottom 0.254: v19.05,11.11 20.64,9.53 22.23,9.53 v24.13,7.62
N$46
  Top 0.254: R2.2 28.57,13.34 26.93,14.98 U1.9
N$47
  Top 0.254: R3.2 31.11,8.26 29.84,9.53 29.84,13.34 27.4,15.78 U1.10
N$48  (1 unrouted)
  Top 0.254: R4.2 30.48,10.79 30.48,13.65 29.21,14.92 29.21,16.83 27.94,18.1 | U1.13 27.86,18.18
N$50
  Top 0.406: LED1.A R_LED.1
N$51  (via drill 0.3)
  Top 0.254: Q5.2 Q6.2 13.92,30.48 14.61,30.48 16.51,32.38 v16.51,33.34
  Bottom 0.254: R10.2 11.75,32.7 12.38,33.34 v16.51,33.34
N$52  (via drill 0.3)
  Top 0.254: Q5.1 Q6.1 R9.1 v11.11,29.21
  Bottom 0.254: R9.1 v11.11,29.21
N$54  (via drill 0.5)  (2 unrouted)
  other vias: 18.73,6.67 17.46,6.67
N$55  (via drill 0.5)  (2 unrouted)
  other vias: 18.73,1.27 17.46,1.27
N$58  (via drill 0.5)  (2 unrouted)
  Top 0.813: 9.77,6.91 v9.21,6.67
  other vias: 10.48,6.67 9.21,1.27 10.48,1.27
  pour Bottom (no thermals): 8.89,6.99 10.48,6.99 12.7,4.76 13.65,4.76 13.65,1.59 11.43,1.59 10.79,0.95 9.21,0.95 8.89,1.27
N$61  (1 unrouted)
  Bottom 0.254: R12.2 3.17,13.02 1.91,14.29 1.91,16.51 4.45,19.05 5.08,19.05
  Bottom 0.61: JP19.1 F1.1
PWM1
  Top 0.254: JP18.1 R1.1
PWM2
  Top 0.254: JP18.3 27.3,4.45 R2.1
PWM3
  Top 0.254: JP18.5 32.38,3.17 31.11,4.45 R3.1
PWM4  (1 unrouted)
  Top 0.254: JP18.7 37.47,4.13 36.19,5.4 33.97,5.4 33.66,5.71
RESET  (via drill 0.3)
  Top 0.254: U1.29 14.37,17.38 13.34,18.41 R_RESET_PUP.1 | R_RESET_PUP.1 13.02,20.64 | R_RTS.2 R_DTR.2 8.89,22.54 9.84,23.5 v9.84,24.45 | J1.5 17.94,33.02 14.45,29.53 14.45,24.45 | v14.29,24.45 14.45,24.45 | 14.45,24.45 14.61,24.45 14.61,21.27 13.97,20.64 R_RESET_PUP.1
  Bottom 0.254: v9.84,24.45 v14.29,24.45
RX  (via drill 0.3)
  Top 0.254: v10.79,23.5 R_TX.2 | U1.30 16.12,16.58 15.88,16.83 13.97,16.83 12.06,18.89 v10.79,18.89
  Bottom 0.254: v10.79,18.89 v10.79,23.5
SCK  (via drill 0.3)
  Top 0.254: U1.17 24.61,22.07 v24.77,22.23 | J1.3 20.32,31.75 20.32,29.53 v19.05,28.26 18.41,28.89 v15.56,28.89
  Bottom 0.254: v24.77,22.23 24.13,22.23 23.5,22.86 20.95,22.86 19.05,24.77 v19.05,28.26 | R9.2 15.24,29.21 v15.56,28.89
SCKOUT  (via drill 0.3)
  Top 0.254: v14.61,32.38 14.61,34.92 13.97,35.56 13.97,38.1 JP17.3
  Bottom 0.254: R10.1 13.97,31.75 v14.61,32.38
TX  (via drill 0.3)
  Top 0.254: U1.31 15.97,15.78 15.56,16.19 13.97,16.19 12.06,18.1 v9.84,18.1 | v8.57,24.13 8.26,23.81 4.45,23.81 3.49,22.86 3.49,22.54 R_RX.2
  Bottom 0.254: v9.84,18.1 9.84,22.86 v8.57,24.13
VIN  (via drill 0.5)
  Top 0.813: U$1.CON1 53.34,7.6 v53.34,5.71 v52.07,5.71
  Bottom 0.813: CIN1.1 57.02,6.86 56.52,6.99 CIN2.1 55.75,6.86 54.61,5.71 v53.34,5.71
  pour Bottom (no thermals): 46.04,5.4 47.62,5.4 48.58,6.03 54.61,6.03 54.61,5.08 53.34,3.81 51.12,3.81 50.16,3.17 46.04,3.17
VUSB  (via drill 0.3)
  Top 0.406: X6.1 12.36,7.33 v12.06,7.62
  Top 0.813: v12.06,8.41 v12.06,7.62 v12.06,6.83
  Bottom 0.813: C_USB2.1 12.7,8.26
  pour Bottom (no thermals): 8.89,8.89 13.65,8.89 13.65,5.4 12.7,5.4 11.43,6.67 11.43,6.99 10.79,7.62 8.89,7.62